# EAGLE design Rev B (EAGLE 6.5.0)

## Sheet 1 of 2: Pre-Amp
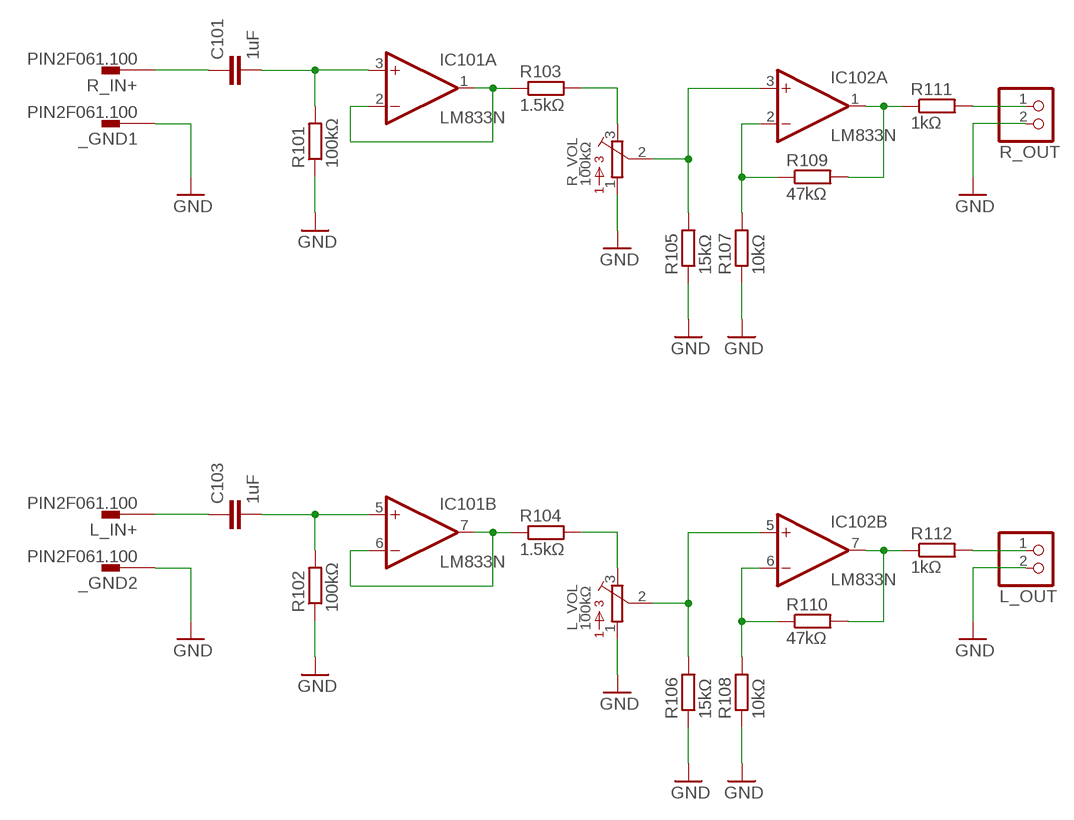
[diagram p0: schematic, sheet 1]

### Parts
_GND1  PIN2F061.100  [F061.100]
_GND2  PIN2F061.100  [F061.100]
C101  1uF  C-EU150-072X183  [C150-072X183]
C103  1uF  C-EU150-072X183  [C150-072X183]
IC101  LM833N  [DIL08]
IC102  LM833N  [DIL08]
L_IN+  PIN2F061.100  [F061.100]
L_OUT  JST_2PIN-THM  [JST-PH-2-THM]
L_VOL  100kΩ  3362U  [3362U]
R101  100kΩ  R-EU_0207/10  [0207/10]
R102  100kΩ  R-EU_0207/10  [0207/10]
R103  1.5kΩ  R-EU_0207/10  [0207/10]
R104  1.5kΩ  R-EU_0207/10  [0207/10]
R105  15kΩ  R-EU_0207/10  [0207/10]
R106  15kΩ  R-EU_0207/10  [0207/10]
R107  10kΩ  R-EU_0207/10  [0207/10]
R108  10kΩ  R-EU_0207/10  [0207/10]
R109  47kΩ  R-EU_0207/10  [0207/10]
R110  47kΩ  R-EU_0207/10  [0207/10]
R111  1kΩ  R-EU_0207/10  [0207/10]
R112  1kΩ  R-EU_0207/10  [0207/10]
R_IN+  PIN2F061.100  [F061.100]
R_OUT  JST_2PIN-THM  [JST-PH-2-THM]
R_VOL  100kΩ  3362U  [3362U]

### Nets
GND: _GND1.A1 _GND1.A2 _GND2.A1 _GND2.A2 L_OUT.2 L_VOL.1 R101.1 R102.1 R105.1 R106.1 R107.1 R108.1 R_OUT.2 R_VOL.1 ; also sheet 2
N$1: L_OUT.1 R112.2
N$2: R111.2 R_OUT.1
N$4: C101.2 IC101.3(A:+IN) R101.2
N$7: C103.2 IC101.5(B:+IN) R102.2
N$8: C101.1 R_IN+.A1 R_IN+.A2
N$22: C103.1 L_IN+.A1 L_IN+.A2
N$56: IC101.1(A:OUT) IC101.2(A:-IN) R103.1
N$58: IC102.3(A:+IN) R105.2 R_VOL.2
N$60: R103.2 R_VOL.3
N$62: IC102.2(A:-IN) R107.2 R109.1
N$63: IC102.1(A:OUT) R109.2 R111.1
N$67: IC101.6(B:-IN) IC101.7(B:OUT) R104.1
N$70: IC102.5(B:+IN) L_VOL.2 R106.2
N$71: L_VOL.3 R104.2
N$78: IC102.6(B:-IN) R108.2 R110.1
N$79: IC102.7(B:OUT) R110.2 R112.1

## Sheet 2 of 2: Power Supply
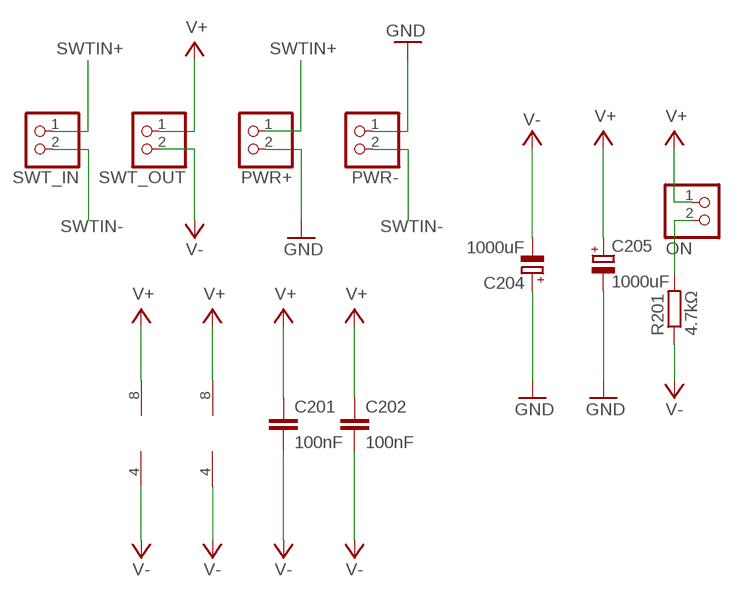
[diagram p1: schematic, sheet 2]

### Parts
C201  100nF  C-EU025-025X050  [C025-025X050]
C202  100nF  C-EU025-025X050  [C025-025X050]
C204  1000uF  CPOL-EUE5-10.5  [E5-10,5]
C205  1000uF  CPOL-EUE5-10.5  [E5-10,5]
ON  JST_2PIN-THM  [JST-PH-2-THM]
PWR+  JST_2PIN-THM  [JST-PH-2-THM]
PWR-  JST_2PIN-THM  [JST-PH-2-THM]
R201  4.7kΩ  R-EU_0207/10  [0207/10]
SWT_IN  JST_2PIN-THM  [JST-PH-2-THM]
SWT_OUT  JST_2PIN-THM  [JST-PH-2-THM]

### Nets
GND: C204.+ C205.- PWR+.2 PWR-.1 ; also sheet 1
N$55: ON.2 R201.2
SWTIN+: PWR+.1 SWT_IN.1
SWTIN-: PWR-.2 SWT_IN.2
V+: C201.1 C202.1 C205.+ IC101.8(P:V+) IC102.8(P:V+) ON.1 SWT_OUT.1
V-: C201.2 C202.2 C204.- IC101.4(P:V-) IC102.4(P:V-) R201.1 SWT_OUT.2

## Library data of the parts
_GND1 _GND2 L_IN+ R_IN+ = con-faston:PIN2: Flachstecker Typ Tyco/Electronics/AMP TAB, FASTON Printed Circuit Board Tabs Source: http://www.buerklin.com, http://catalog.tycoelectronics.com; OC_FARNELL: unknown; OC_NEWARK: unknown
C101 C103 C201 C202 = rcl:C-EU: CAPACITOR, European symbol
C204 C205 = rcl:CPOL-EU: POLARIZED CAPACITOR, European symbol
IC101 IC102 = linear:LM833: OP AMP
L_OUT ON PWR+ PWR- R_OUT SWT_IN SWT_OUT = adafruit:JST_2PIN: JST 2-Pin Connectors of various flavors SMT-RA (S2B-PH-SM4) 4UConnector #17311 SMT (B2B-PH-SM4) THM-RA (S2B-PH) THM (B2B-PH)
L_VOL R_VOL = bourns:3362: 3362 Series 1/4" Square Trimmer
R101-R112 R201 = rcl:R-EU_: RESISTOR, European symbol

## Board
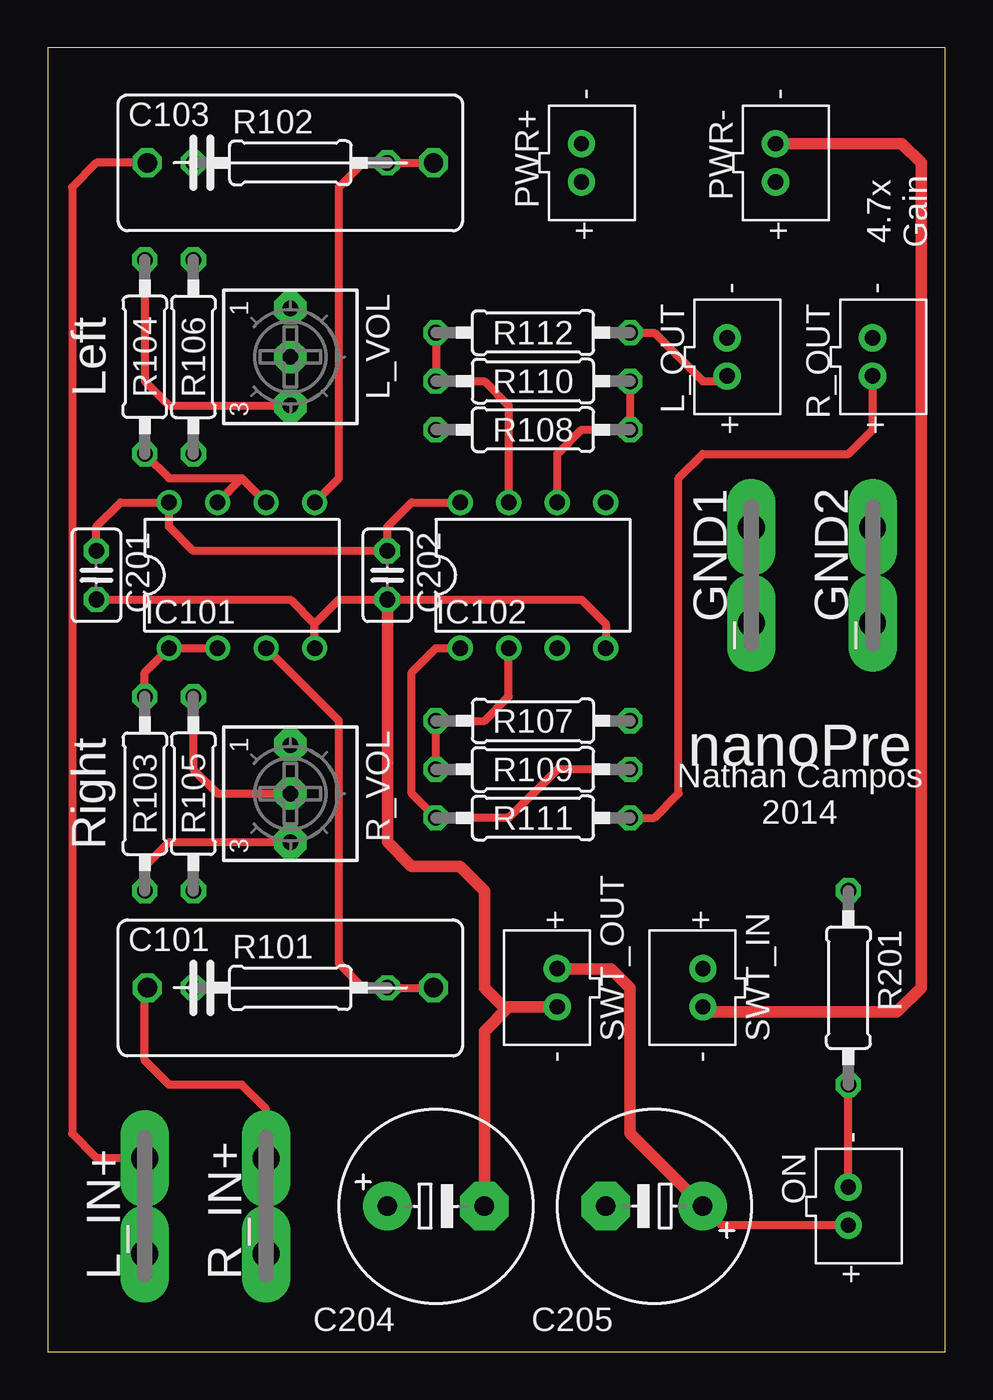
[diagram p2: board, top side]
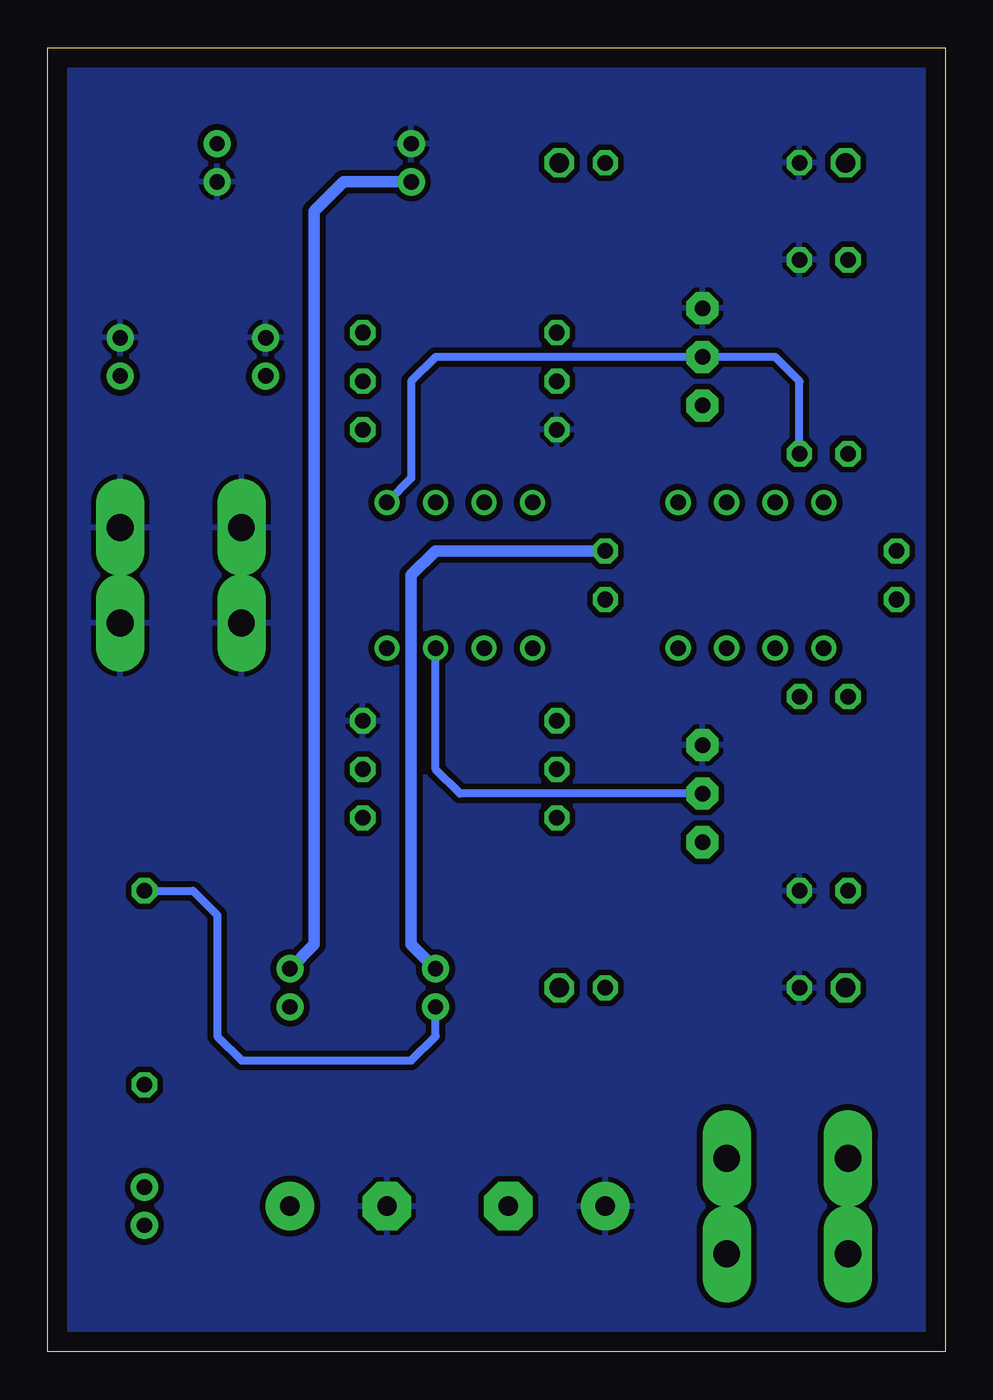
[diagram p3: board, bottom side, seen from below]

Size 46.97 x 68.25 mm. Coordinates in mm from the lower left corner, seen from the top.
Outline: 0,0 46.97,0 46.97,68.25 0,68.25 0,0
Copper layers (1*16): Top 0.035mm / dielectric 1.5mm / Bottom 0.035mm
Design rules "default": minimum track width 10mil, minimum drill 24mil, track to track 8mil, track to pad 8mil, pad to pad 8mil, via to via 8mil, smd to smd 8mil, copper to edge 40mil, drill to drill 8mil, minimum pad ring 10mil, minimum via ring 8mil, stop-mask expansion 4mil, vias tented up to drill 0mil, thermal gap 10mil

### Footprints (pad centres in the part's own frame; a part is rotated, then mirrored left to right if it is on the bottom)
F061.100 = drill 1.4 pad 2.54 long: A1 -2.5,0; A2 2.5,0
C150-072X183 = drill 1.016 octagon: 1 -7.493,0; 2 7.493,0
C025-025X050 = drill 0.813 octagon: 1 -1.27,0; 2 1.27,0
E5-10,5 = drill 1.016 pad 2.54: + -2.54,0 | drill 1.016 pad 2.54 octagon: - 2.54,0
DIL08 = drill 0.813 pad 1.27: 1 -3.81,-3.81; 2 -1.27,-3.81; 3 1.27,-3.81; 4 3.81,-3.81; 5 3.81,3.81; 6 1.27,3.81; 7 -1.27,3.81; 8 -3.81,3.81
JST-PH-2-THM = drill 0.8 pad 1.422: 1 1,0; 2 -1,0
3362U = drill 0.813 pad 1.676 octagon: 1 -2.54,0; 2 0,0; 3 2.54,0
0207/10 = drill 0.813 octagon: 1 -5.08,0; 2 5.08,0

### Placement (x,y rotation side)
_GND1  36.83,40.64 90 top
_GND2  43.18,40.64 90 top
C101  12.7,19.05 0 top
C103  12.7,62.23 0 top
C201  2.54,40.64 270 top
C202  17.78,40.64 270 top
C204  20.32,7.62 0 top
C205  31.75,7.62 180 top
IC101  10.16,40.64 0 top
IC102  25.4,40.64 0 top
L_IN+  5.08,7.62 90 top
L_OUT  35.56,52.07 270 top
L_VOL  12.7,52.07 270 top
ON  41.91,7.62 270 top
PWR+  27.94,62.23 270 top
PWR-  38.1,62.23 270 top
R101  12.7,19.05 0 top
R102  12.7,62.23 0 top
R103  5.08,29.21 270 top
R104  5.08,52.07 90 top
R105  7.62,29.21 90 top
R106  7.62,52.07 270 top
R107  25.4,33.02 180 top
R108  25.4,48.26 0 top
R109  25.4,30.48 0 top
R110  25.4,50.8 180 top
R111  25.4,27.94 0 top
R112  25.4,53.34 0 top
R201  41.91,19.05 270 top
R_IN+  11.43,7.62 90 top
R_OUT  43.18,52.07 270 top
R_VOL  12.7,29.21 270 top
SWT_IN  34.29,19.05 90 top
SWT_OUT  26.67,19.05 90 top

### Tracks (layer width: path | path; a pad name or v marks a point on that pad's centre or on a via)
GND
  pour Bottom (isolate 0.305): 0,68.58 46.99,68.58 46.99,0 0,0
N$1
  Top 0.406: R112.2 31.75,53.34 34.29,50.8 35.29,50.8 L_OUT.1
N$2
  Top 0.406: R111.2 31.75,27.94 33.02,29.21 33.02,45.72 34.29,46.99 41.91,46.99 43.18,48.26 R_OUT.1
N$4
  Top 0.406: C101.2 R101.2 16.51,19.05 15.24,20.32 15.24,33.02 IC101.3
N$7
  Top 0.406: C103.2 R102.2 16.51,62.23 15.24,60.96 15.24,45.72 IC101.5
N$8
  Top 0.406: R_IN+.A1 R_IN+.A2 11.43,12.7 10.16,13.97 6.35,13.97 5.08,15.24 5.08,18.92 C101.1
N$22
  Top 0.406: C103.1 2.54,62.23 1.27,60.96 1.27,11.43 2.54,10.16 5.04,10.16 L_IN+.A2 L_IN+.A1
N$55
  Top 0.406: ON.2 R201.2
N$56
  Top 0.406: R103.1 5.08,35.56 IC101.1 IC101.2
N$58
  Top 0.406: R105.2 7.62,30.48 8.89,29.21 R_VOL.2
  Bottom 0.406: R_VOL.2 25.4,29.21 26.67,30.48 IC102.3
N$60
  Top 0.406: R103.2 5.08,25.4 6.35,26.67 R_VOL.3
N$62
  Top 0.406: R109.1 R107.2 22.86,33.02 24.13,34.29 IC102.2
N$63
  Top 0.406: IC102.1 20.32,36.83 19.05,35.56 19.05,29.21 R111.1 24.13,27.94 26.67,30.48 R109.2
N$67
  Top 0.406: R104.1 6.35,45.72 10.16,45.72 | 10.16,45.72 IC101.6 | IC101.7 10.16,45.72
N$70
  Bottom 0.406: R106.2 7.62,50.8 8.89,52.07 L_VOL.2 26.67,52.07 27.94,50.8 27.94,45.72 IC102.5
N$71
  Top 0.406: R104.2 5.08,50.8 6.35,49.53 L_VOL.3
N$78
  Top 0.406: R110.1 R108.2 27.94,48.26 26.67,46.99 IC102.6
N$79
  Top 0.406: R112.1 R110.2 22.86,50.8 24.13,49.53 IC102.7
SWTIN+
  Bottom 0.61: PWR+.1 31.48,61.23 33.02,59.69 33.02,21.32 SWT_IN.1
SWTIN-
  Top 0.61: PWR-.2 44.72,63.23 45.72,62.23 45.72,19.05 44.45,17.78 34.56,17.78 SWT_IN.2
V+
  Top 0.406: C201.1 2.54,43.18 3.81,44.45 IC101.8 6.35,43.18 7.62,41.91 C202.1 17.78,43.18 19.05,44.45 IC102.8 | ON.1 35.29,6.62 C205.+
  Top 0.61: SWT_OUT.1 29.48,20.05 30.48,19.05 30.48,11.43 C205.+
  Bottom 0.61: C202.1 26.67,41.91 27.94,40.64 27.94,21.32 SWT_OUT.1
V-
  Top 0.406: C201.2 12.7,39.37 13.97,38.1 | IC101.4 13.97,38.1 | 13.97,38.1 15.24,39.37 C202.2 27.94,39.37 29.21,38.1 IC102.4
  Top 0.61: SWT_OUT.2 24.13,18.05 | 24.13,18.05 23.86,18.05 22.86,19.05 22.86,24.13 21.59,25.4 19.05,25.4 17.78,26.67 C202.2 | C204.- 22.86,16.78 24.13,18.05
  Bottom 0.406: R201.1 39.37,24.13 38.1,22.86 38.1,16.51 36.83,15.24 27.94,15.24 26.67,16.51 SWT_OUT.2

### Text on the board
tPlace: 4.7x / Gain | Left | nanoPre | Right | Nathan Campos / 2014